# Altium project Optocoupler.PrjPcb
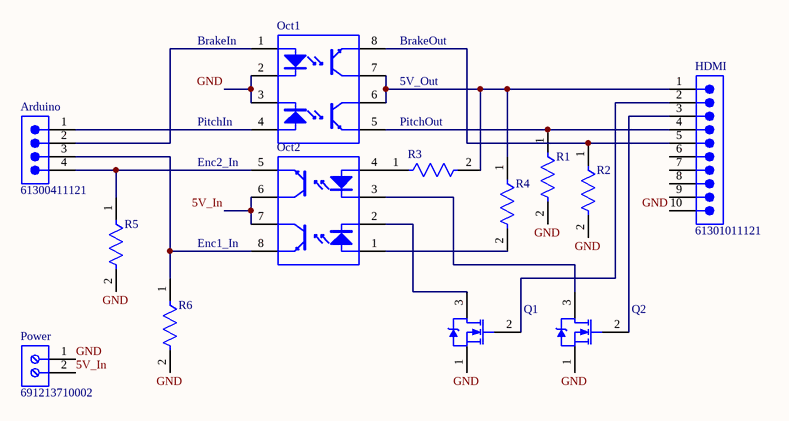
[diagram p0: Optocoupler.SchDoc]
1 sheet, 13 parts. Net scope: global (net labels, ports and power ports of the same name join across sheets).
Board files: Optocoupler.PcbDoc, OptocouplerShop.PcbDoc

## Sheet Optocoupler.SchDoc
size A; SheetNumber: 1; SheetTotal: 1

### Parts
Arduino  61300411121  [61300411121]
HDMI  61301011121  [61301011121]
Oct1  (no value)  [VISH-DIP8]
Oct2  (no value)  [VISH-DIP8]
Power  691213710002  [691213710002]
Q1  (no value)  [ONSC-TO-92-3-29-11_AM_BL]
Q2  (no value)  [ONSC-TO-92-3-29-11_AM_BL]
R1  (no value)  [FP-MRS25-MFG]
R2  (no value)  [FP-MRS25-MFG]
R3  (no value)  [FP-MRS25-MFG]
R4  (no value)  [FP-MRS25-MFG]
R5  (no value)  [FP-MRS25-MFG]
R6  (no value)  [FP-MRS25-MFG]

### Nets
5V_In: Oct2.6(C) Oct2.7(C) Power.2
GND: HDMI.10 Oct1.2(C) Oct1.3(C) Power.1 Q1.1(S) Q2.1(S) R1.2 R2.2 R5.2 R6.2
NetArduino_1: Arduino.1 Oct1.4(A)
NetArduino_2: Arduino.2 Oct1.1(A)
NetArduino_3: Arduino.3 Oct2.8(E) R6.1
NetArduino_4: Arduino.4 Oct2.5(E) R5.1
NetHDMI_1: HDMI.1 Oct1.6(C) Oct1.7(C) R3.2 R4.1
NetHDMI_2: HDMI.2 Q1.2(G)
NetHDMI_3: HDMI.3 Q2.2(G)
NetHDMI_4: HDMI.4 Oct1.5(E) R1.1
NetHDMI_5: HDMI.5 Oct1.8(E) R2.1
NetOct2_1: Oct2.1(A) R4.2
NetOct2_2: Oct2.2(C) Q1.3(D)
NetOct2_3: Oct2.3(C) Q2.3(D)
NetOct2_4: Oct2.4(A) R3.1

Not connected (* = marked no-connect by the designer): HDMI 6 7 8 9

### Notes on the sheet
- (near Oct1) BrakeIn
- (near Oct1) 5V_Out
- (near Oct1) BrakeOut
- PitchIn
- PitchOut
- Enc2_In
- Enc1_In

### Library data of the parts
Arduino = CMP-1502-01064-3: NexarPartId: 32855522; Operating Supply Voltage: 250V; Pitch: 2.54mm; Contact Resistance: 20mΩ; Number of Positions: 4; Current Rating: 3A; Connector Type: Male Pin; Gender: Male; Contact Plating: Gold; Height: 8.89mm; Lead Pitch: 2.54mm; Lead Free: Lead Free; Contact Mating Length: 5.9944mm; Number of Rows: 1; Termination: Solder; Packaging: Bulk; REACH SVHC: Unknown; Min Operating Temperature: -40°C; RoHS: Compliant; Number of Contacts: 4; Voltage Rating: 250V; Color: Black; Max Operating Temperature: 105°C; Contact Material: Copper; Mount: Through Hole; Orientation: Vertical; Number of Pins: 4
HDMI = CMP-1502-01082-5: NexarPartId: 18818159; Gender: Male; Number of Positions: 10; Operating Supply Voltage: 250V; Current Rating: 3A; Contact Resistance: 20mΩ; Connector Type: Male Pin; Insulation Resistance: 1GΩ; Pitch: 2.54mm; Color: Black; Contact Gender: Male; Height: 8.74mm; Orientation: Vertical; RoHS: Compliant; Packaging: Bulk; Min Operating Temperature: -40°C; Number of Pins: 10; Max Operating Temperature: 105°C; REACH SVHC: Unknown; Voltage Rating: 250V; Number of Rows: 1; Housing Material: PBT; Number of Contacts: 10; Mount: Through Hole; Contact Mating Length: 5.9944mm; Length: 2.54mm; Lead Pitch: 2.54mm; Flammability Rating: UL94 V-0; Termination: Solder; Contact Material: Copper; Width: 25.4mm; Contact Plating: Gold
Oct1 Oct2 = CMP-1666-00026-1: Optocoupler, Phototransistor Output, Dual Channel, 1.3 V, -55 to 100 degC, 8-Pin DIP, RoHS, Tube; Case\Package: Axial; Power Rating: 250 mW; Voltage Rating: 250 V; Tolerance: 1%; Resistance: 22.1 Ohm; ComponentLink3Description: Package Specification; ComponentLink3URL: http://www.vishay.com/docs/83241/83241.pdf; Mount: Through Hole; DatasheetVersion: Rev. 1.7, 05/2011; PackageVersion: Rev. 1.1, 12/2003; Package Quantity: 200; PackageReference: DIP8; Min Operating Temperature: -55 degC; Length: 0.248 inch; ComponentLink2URL: http://www.vishay.com/docs/83640/ild74.pdf; Packaging: Bulk; RoHSCompliant: true; ComponentLink1URL: http://www.vishay.com/; PackageDescription: 8-Pin Double In-line Package, Body 9.77 x 6.645 mm, Pitch 2.54 mm; ComponentLink1Description: Manufacturer URL; Max Operating Temperature: 155 degC; ComponentLink2Description: Datasheet
Power = CMP-1502-02526-2: NexarPartId: 8917718; Number of Contacts: 2; Current Rating: 10A; Stripping Length: -7mm; Wire Gauge (Max): 26AWG; Plating: Brass, Steel; Wire Gauge (Min): 16AWG; Voltage: 300V; Number of Levels: 1; Pitch: 5.0038mm; Color: Green; Number of Pins: 2; Housing Material: Nylon; Termination: Screw; Max Operating Temperature: 105°C; Min Operating Temperature: -40°C; Packaging: Box; Current: 10A; REACH SVHC: Unknown; Width: 10.6mm; RoHS: Compliant; Mount: Through Hole; Height: 10mm; Contact Material: Brass; Length: 8.3mm; Lead Pitch: 5mm; Wire/Cable Gauge: 26AWG; Voltage Rating: 300V; Number of Positions Per Level: 2; Contact Plating: Tin
Q1 Q2 = CMP-1058-00942-1: Small Signal MOSFET, 200 mA, 60 V, N-Channel, 3-Pin TO-92, Pb-Free, Tape and Reel; Manufacturer: On Semiconductor; PartNumber: 2N7000RLRAG; Crss Typ (pF): 5; Ciss Typ (pF): 60; Channel Polarity: N Channel; Coss Typ (pF): 25; VGS(th) Max (V): 3; ID Max (A): 0.2; VGS Max (V): 20; Configuration: Single; PD Max (W): 0.35; ComponentLink3Description: Package Specification; Package Type: TO-92; Mounting Technology: Through Hole; ComponentLink2Description: Datasheet; ComponentLink1Description: Manufacturer URL; ComponentLink1URL: http://www.onsemi.com/; DatasheetVersion: Rev. 8; RoHS: Pb-Free; Packing: Tape and Reel; PackageReference: TO-92-3-29-11_AM_BL; ComponentLink3URL: http://www.onsemi.com/pub_link/Collateral/MAC97-D.PDF; PackageDescription: 3-Pin Transistor Outline, Body 4.825 x 3.685 mm, Pitch 1.27 mm; PackageVersion: Rev. AM; ComponentLink2URL: http://www.onsemi.com/pub_link/Collateral/2N7000-D.PDF; V(BR)DSS Min (V): 60
R1-R6 = CMP-00030-42757237-1: MRS25000C1000FRP00 Resistor, 100 Ohm, ± 1%, 600 mW, Axial Leaded, Metal Film (Thin Film), Professional; Max Power Dissipation: 600mW; Resistance: 100Ω; Voltage Rating: 350V; Temperature Coefficient: 50ppm/°C; Lead Diameter: 600µm; RoHS: Compliant; Radiation Hardening: No; Schedule B: 8533210090, 8533210090; Length: 6.5mm; Packaging: Tape & Reel (TR); Number of Terminations: 2; Mount: Through Hole; Width: 2.5mm; Tolerance: 1%; Military Standard: Not; Voltage Rating (DC): 350V; Contact Plating: Tin; Number of Pins: 2; Max Operating Temperature: 155°C; NexarPartId: 42757237; Diameter: 2.5mm; Composition: Metal Film, Thin Film; REACH SVHC: Unknown; Power Rating: 600mW; Lead Free: Lead Free; Termination: Axial; Case/Package: Axial; Min Operating Temperature: -55°C